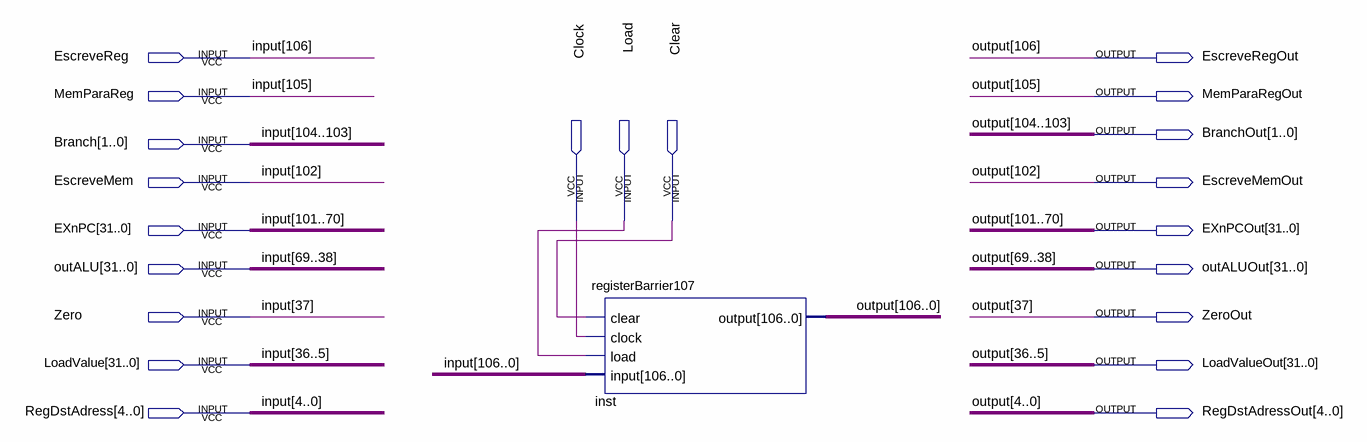
[diagram p0: schematic sheet]
// Quartus schematic EXMEM.bdf as structural Verilog: 1 symbols, 21 pins
module EXMEM (
  input  EscreveReg,
  input  MemParaReg,
  input  [1:0] Branch,
  input  EscreveMem,
  input  Clock,
  input  Load,
  input  Clear,
  input  [31:0] EXnPC,
  input  [31:0] outALU,
  input  Zero,
  input  [31:0] LoadValue,
  input  [4:0] RegDstAdress,
  output EscreveRegOut,
  output MemParaRegOut,
  output [1:0] BranchOut,
  output EscreveMemOut,
  output [31:0] EXnPCOut,
  output [31:0] outALUOut,
  output ZeroOut,
  output [31:0] LoadValueOut,
  output [4:0] RegDstAdressOut
);

  registerBarrier107 inst (
    .clear(Clear), .clock(Clock), .load(Load),
    .\input ({EscreveReg, MemParaReg, Branch, EscreveMem, EXnPC, outALU, Zero, LoadValue, RegDstAdress}),
    .\output ({EscreveRegOut, MemParaRegOut, BranchOut, EscreveMemOut, EXnPCOut, outALUOut, ZeroOut, LoadValueOut, RegDstAdressOut}));

  // Other names for the same wires on the sheet: input[106:0] = {EscreveReg, MemParaReg, Branch, EscreveMem, EXnPC, outALU, Zero, LoadValue, RegDstAdress};
  //   output[106:0] = {EscreveRegOut, MemParaRegOut, BranchOut, EscreveMemOut, EXnPCOut, outALUOut, ZeroOut, LoadValueOut, RegDstAdressOut}
endmodule
